# Altium schematic sheet AD.SchDoc
size A4
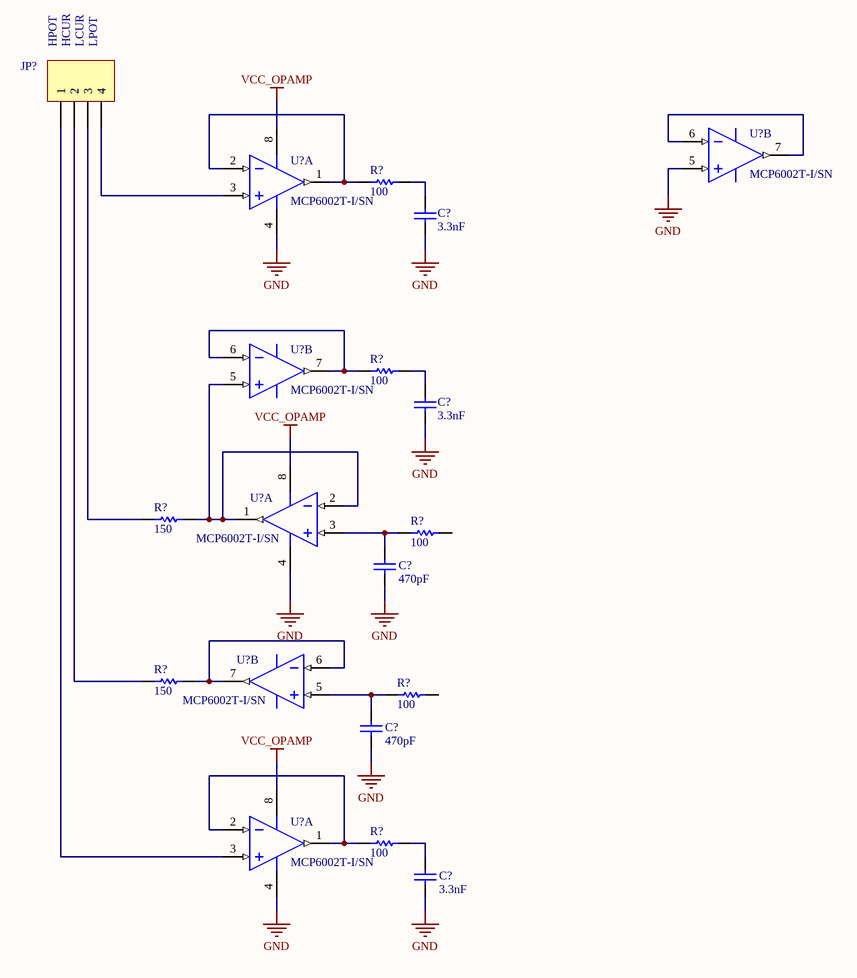
[diagram p0: AD.SchDoc]

## Parts
(Parts that share a designator on the sheet are numbered #1, #2 ... from top to bottom, then left to right.)
C?#1  value 3.3nF  [new_0805]  (hidden comment: Cap)
C?#2  value 3.3nF  [new_0805]  (hidden comment: Cap)
C?#3  value 470pF  [new_0805]  (hidden comment: Cap)
C?#4  value 470pF  [new_0805]  (hidden comment: Cap)
C?#5  value 3.3nF  [new_0805]  (hidden comment: Cap)
JP?  Header 4  [HDR1X4]  (value not drawn)
R?#1  value 100  [new_0805]  (hidden comment: Res1)
R?#2  value 100  [new_0805]  (hidden comment: Res1)
R?#3  value 150  [new_0805]  (hidden comment: Res1)
R?#4  value 100  [new_0805]  (hidden comment: Res1)
R?#5  value 150  [new_0805]  (hidden comment: Res1)
R?#6  value 100  [new_0805]  (hidden comment: Res1)
R?#7  value 100  [new_0805]  (hidden comment: Res1)
U?#1  MCP6002T-I/SN  [SOIC-SN8_N]  (part B of 2)
U?#2  MCP6002T-I/SN  [SOIC-SN8_N]  (part A of 2)
U?#3  MCP6002T-I/SN  [SOIC-SN8_N]  (part B of 2)
U?#4  MCP6002T-I/SN  [SOIC-SN8_N]  (part A of 2)
U?#5  MCP6002T-I/SN  [SOIC-SN8_N]  (part B of 2)
U?#6  MCP6002T-I/SN  [SOIC-SN8_N]  (part A of 2)

## Nets
GND: C?#1.2 C?#2.2 C?#3.1 C?#4.1 C?#5.1 U?#1.5(VINB+) U?#2.4(VSS) U?#4.4(VSS) U?#6.4(VSS)
VCC_OPAMP: U?#2.8(VDD) U?#4.8(VDD) U?#6.8(VDD)
NetC?#1_1: C?#1.1 R?#1.2
NetC?#2_1: C?#2.1 R?#2.2
NetC?#3_2: C?#3.2 R?#4.1 U?#4.3(VINA+)
NetC?#4_2: C?#4.2 R?#6.1 U?#5.5(VINB+)
NetC?#5_2: C?#5.2 R?#7.2
NetJP?_1: JP?.1 U?#6.3(VINA+)
NetJP?_2: JP?.2 R?#5.1
NetJP?_3: JP?.3 R?#3.1
NetJP?_4: JP?.4 U?#2.3(VINA+)
NetR?#1_1: R?#1.1 U?#2.1(VOUTA) U?#2.2(VINA-)
NetR?#2_1: R?#2.1 U?#3.6(VINB-) U?#3.7(VOUTB)
NetR?#3_2: R?#3.2 U?#3.5(VINB+) U?#4.1(VOUTA) U?#4.2(VINA-)
NetR?#5_2: R?#5.2 U?#5.6(VINB-) U?#5.7(VOUTB)
NetR?#7_1: R?#7.1 U?#6.1(VOUTA) U?#6.2(VINA-)
NetU?#1_6: U?#1.6(VINB-) U?#1.7(VOUTB)

Not connected (* = marked no-connect by the designer): R?#4 2; R?#6 2; U?#1 4(VSS) 8(VDD); U?#3 4(VSS) 8(VDD); U?#5 4(VSS) 8(VDD)

## Notes on the sheet
- HPOT
- HCUR
- LCUR
- LPOT

## Library data of the parts
C?#1-C?#5 = Cap: Capacitor; Published: 8-Jun-2000; LatestRevisionDate: 17-Jul-2002; LatestRevisionNote: Re-released for DXP Platform.; PackageReference: RAD-0.3; Publisher: Altium Limited; PackageDescription: Radial Cap, Thru-Hole; 2 Leads; 0.3 in Pin Spacing
JP? = Header 4: Header, 4-Pin; LatestRevisionDate: 17-Jul-2002; LatestRevisionNote: Re-released for DXP Platform.; Publisher: Altium Limited
R?#1-R?#7 = Res1: Resistor; Published: 8-Jun-2000; LatestRevisionDate: 17-Jul-2002; LatestRevisionNote: Re-released for DXP Platform.; PackageReference: AXIAL-0.3; Publisher: Altium Limited; PackageDescription: Axial Device, Thru-Hole; 2 Leads; 0.3 in Pin Spacing
U?#1-U?#6 = MCP6002T-I/SN: 1 MHz, Low-Power Operational Amplifier, 8-Pin SOIC, Industrial Temperature, Tape and Reel; Manufacturer: Microchip; DatasheetVersion: revJ, Nov-2009; PackageVersion: revBB, Aug-2009; PackageReference: SOIC-SN8; PackageDescription: 8-Lead Plastic Small Outline (SN) - Narrow, 3.90mm Body [SOIC]; Supplier 1: Digi-Key; Supplier Part Number 1: MCP6002T-I/SN-ND; Supplier 2: Newark; Supplier Part Number 2: 72C4274; Supplier 3: Mouser; Supplier Part Number 3: 579-MCP6002T-I/SN; Mounting Technology: Surface Mount; Code_JEDEC: MS-012; Code_IPC: SOIC127P600-8; PartNumber: MCP6002T-I/SN; ComponentLink1Description: Manufacturer URL; ComponentLink1URL: http://www.microchip.com/; ComponentLink2Description: Datasheet; ComponentLink2URL: http://ww1.microchip.com/downloads/en/DeviceDoc/21733j.pdf; ComponentLink3Description: Package Specification; ComponentLink3URL: http://www.microchip.com/stellent/groups/techpub_sg/documents/packagingspec/en012702.pdf